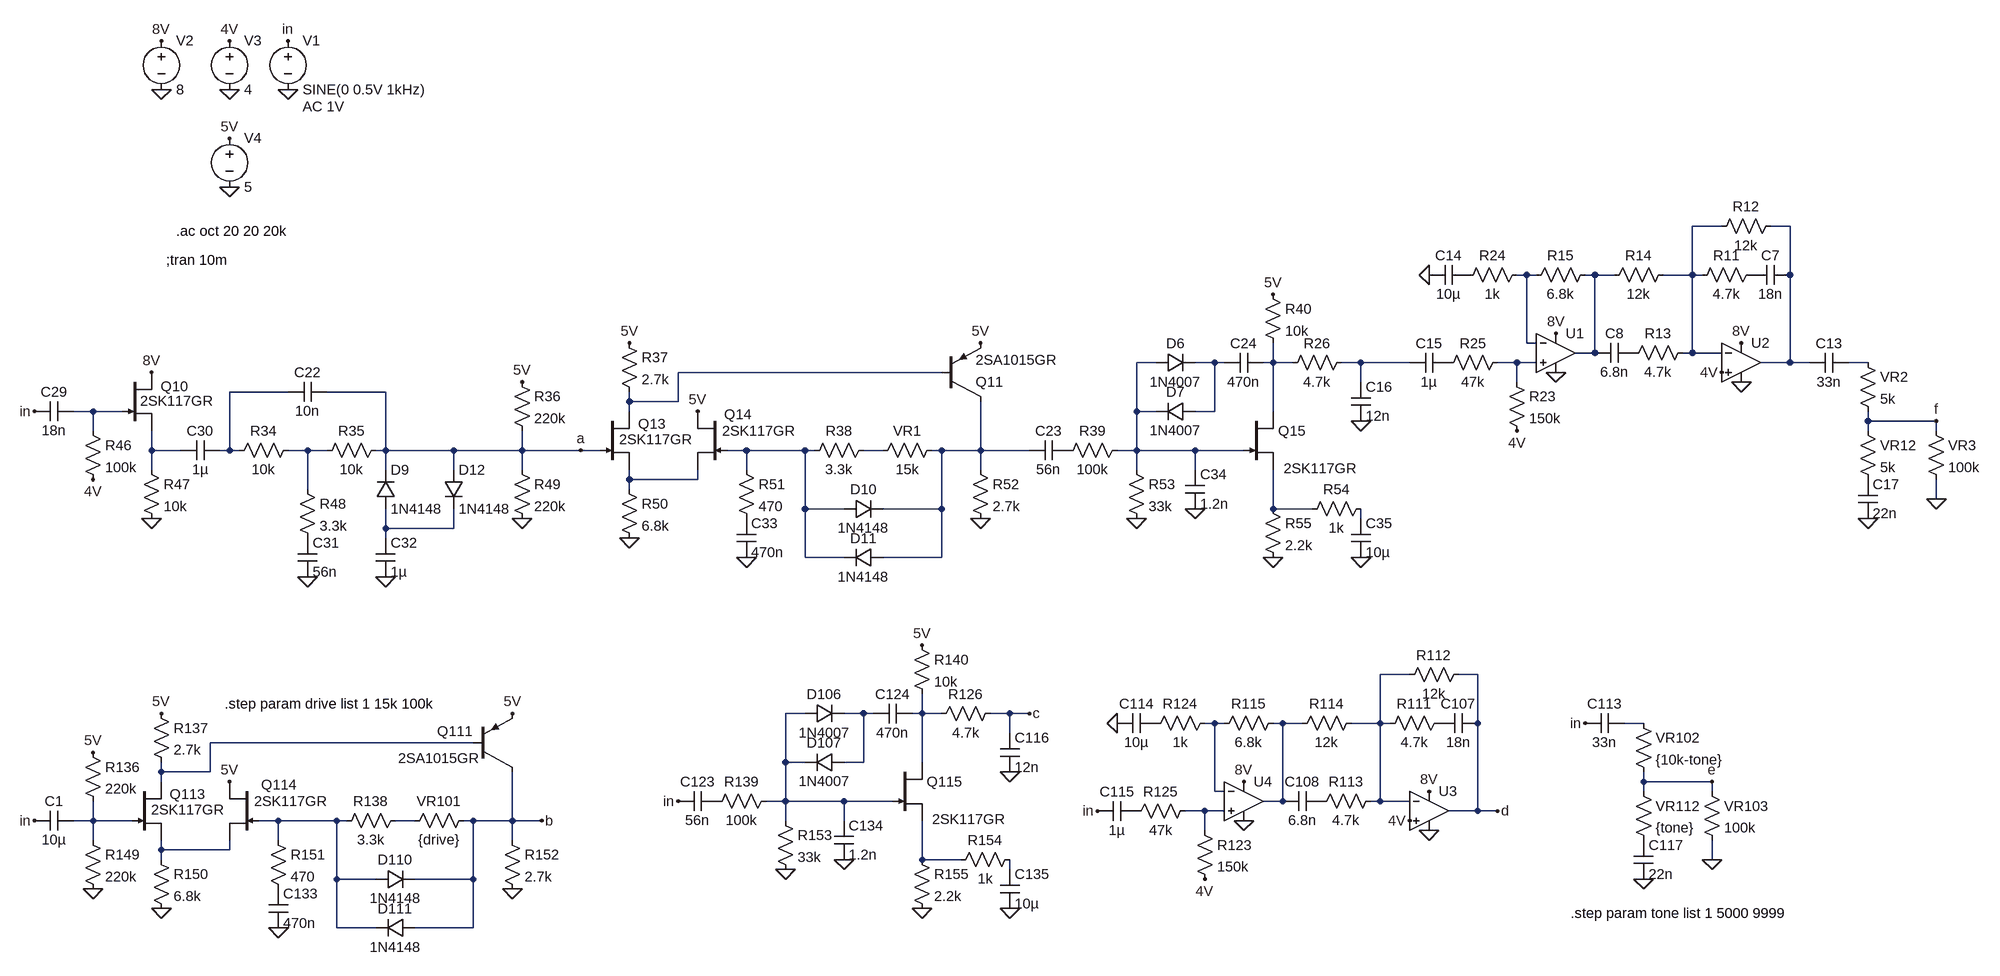
[diagram p0: schematic od3.asc]
od3.asc, the LTspice schematic file:
Version 4
SHEET 1 1624 1740
WIRE 368 -1216 320 -1216
WIRE 480 -1216 448 -1216
WIRE 48 -1136 32 -1136
WIRE 64 -1136 48 -1136
WIRE 160 -1136 144 -1136
WIRE 192 -1136 160 -1136
WIRE 320 -1136 320 -1216
WIRE 320 -1136 272 -1136
WIRE 336 -1136 320 -1136
WIRE 480 -1136 480 -1216
WIRE 48 -1024 48 -1136
WIRE 64 -1024 48 -1024
WIRE 160 -1008 160 -1136
WIRE 160 -1008 128 -1008
WIRE 320 -1008 320 -1136
WIRE 320 -1008 304 -1008
WIRE 368 -1008 320 -1008
WIRE -560 -992 -592 -992
WIRE -464 -992 -496 -992
WIRE -448 -992 -464 -992
WIRE -368 -992 -368 -1024
WIRE -368 -992 -384 -992
WIRE -336 -992 -368 -992
WIRE -224 -992 -256 -992
WIRE -144 -992 -224 -992
WIRE 32 -992 0 -992
WIRE 64 -992 32 -992
WIRE 480 -992 480 -1136
WIRE 480 -992 432 -992
WIRE 512 -992 480 -992
WIRE 608 -992 576 -992
WIRE -912 -976 -1344 -976
WIRE -224 -960 -224 -992
WIRE 32 -960 32 -992
WIRE -1984 -944 -2080 -944
WIRE -1824 -944 -1920 -944
WIRE -1424 -928 -1424 -944
WIRE -1344 -928 -1344 -976
WIRE -1344 -928 -1424 -928
WIRE -2304 -912 -2336 -912
WIRE -2256 -912 -2304 -912
WIRE -1424 -912 -1424 -928
WIRE -592 -912 -592 -992
WIRE -560 -912 -592 -912
WIRE -464 -912 -464 -992
WIRE -464 -912 -496 -912
WIRE -368 -912 -368 -992
WIRE 608 -896 608 -912
WIRE 720 -896 608 -896
WIRE -2304 -880 -2304 -912
WIRE 608 -880 608 -896
WIRE 720 -880 720 -896
WIRE -2208 -848 -2208 -880
WIRE -2160 -848 -2208 -848
WIRE -2080 -848 -2080 -944
WIRE -2080 -848 -2096 -848
WIRE -2064 -848 -2080 -848
WIRE -1952 -848 -1984 -848
WIRE -1920 -848 -1952 -848
WIRE -1824 -848 -1824 -944
WIRE -1824 -848 -1840 -848
WIRE -1712 -848 -1824 -848
WIRE -1600 -848 -1600 -880
WIRE -1600 -848 -1712 -848
WIRE -1504 -848 -1600 -848
WIRE -1472 -848 -1504 -848
WIRE -1232 -848 -1264 -848
WIRE -1136 -848 -1232 -848
WIRE -1120 -848 -1136 -848
WIRE -1008 -848 -1040 -848
WIRE -912 -848 -928 -848
WIRE -848 -848 -848 -928
WIRE -848 -848 -912 -848
WIRE -768 -848 -848 -848
WIRE -592 -848 -592 -912
WIRE -592 -848 -624 -848
WIRE -496 -848 -592 -848
WIRE -416 -848 -496 -848
WIRE -2208 -816 -2208 -848
WIRE -1824 -816 -1824 -848
WIRE -1712 -816 -1712 -848
WIRE -1600 -816 -1600 -848
WIRE -1232 -816 -1232 -848
WIRE -848 -816 -848 -848
WIRE -592 -816 -592 -848
WIRE -496 -816 -496 -848
WIRE -1424 -800 -1424 -816
WIRE -1312 -800 -1312 -816
WIRE -1312 -800 -1424 -800
WIRE -1952 -784 -1952 -848
WIRE -1424 -784 -1424 -800
WIRE 720 -768 720 -800
WIRE -1136 -752 -1136 -848
WIRE -1072 -752 -1136 -752
WIRE -912 -752 -912 -848
WIRE -912 -752 -1008 -752
WIRE -368 -752 -368 -816
WIRE -304 -752 -368 -752
WIRE -224 -736 -224 -752
WIRE -1824 -720 -1824 -752
WIRE -1712 -720 -1712 -752
WIRE -1712 -720 -1824 -720
WIRE -1824 -704 -1824 -720
WIRE -1136 -672 -1136 -752
WIRE -1072 -672 -1136 -672
WIRE -912 -672 -912 -752
WIRE -912 -672 -1008 -672
WIRE -144 -480 -192 -480
WIRE -32 -480 -64 -480
WIRE -1136 -416 -1168 -416
WIRE -1040 -416 -1072 -416
WIRE -1024 -416 -1040 -416
WIRE -944 -416 -944 -448
WIRE -944 -416 -960 -416
WIRE -912 -416 -944 -416
WIRE -800 -416 -832 -416
WIRE -768 -416 -800 -416
WIRE -464 -400 -480 -400
WIRE -448 -400 -464 -400
WIRE -352 -400 -368 -400
WIRE -320 -400 -352 -400
WIRE -192 -400 -192 -480
WIRE -192 -400 -240 -400
WIRE -176 -400 -192 -400
WIRE -32 -400 -32 -480
WIRE 240 -400 208 -400
WIRE -800 -384 -800 -416
WIRE -1680 -368 -2112 -368
WIRE -1168 -336 -1168 -416
WIRE -1136 -336 -1168 -336
WIRE -1040 -336 -1040 -416
WIRE -1040 -336 -1072 -336
WIRE -944 -336 -944 -416
WIRE -2192 -320 -2192 -336
WIRE -2112 -320 -2112 -368
WIRE -2112 -320 -2192 -320
WIRE -2192 -304 -2192 -320
WIRE 240 -304 240 -320
WIRE 352 -304 240 -304
WIRE -464 -288 -464 -400
WIRE -448 -288 -464 -288
WIRE 240 -288 240 -304
WIRE 352 -288 352 -304
WIRE -1168 -272 -1168 -336
WIRE -1168 -272 -1200 -272
WIRE -1072 -272 -1168 -272
WIRE -992 -272 -1072 -272
WIRE -352 -272 -352 -400
WIRE -352 -272 -384 -272
WIRE -192 -272 -192 -400
WIRE -192 -272 -208 -272
WIRE -144 -272 -192 -272
WIRE -480 -256 -512 -256
WIRE -448 -256 -480 -256
WIRE -32 -256 -32 -400
WIRE -32 -256 -80 -256
WIRE 0 -256 -32 -256
WIRE -2304 -240 -2304 -272
WIRE -2304 -240 -2336 -240
WIRE -2240 -240 -2304 -240
WIRE -2000 -240 -2032 -240
WIRE -1904 -240 -2000 -240
WIRE -1888 -240 -1904 -240
WIRE -1776 -240 -1808 -240
WIRE -1680 -240 -1696 -240
WIRE -1616 -240 -1616 -320
WIRE -1616 -240 -1680 -240
WIRE -1568 -240 -1616 -240
WIRE -1168 -240 -1168 -272
WIRE -1072 -240 -1072 -272
WIRE -480 -224 -480 -256
WIRE -2304 -208 -2304 -240
WIRE -2000 -208 -2000 -240
WIRE -1616 -208 -1616 -240
WIRE -2192 -192 -2192 -208
WIRE -2080 -192 -2080 -208
WIRE -2080 -192 -2192 -192
WIRE -2192 -176 -2192 -192
WIRE -944 -176 -944 -240
WIRE -880 -176 -944 -176
WIRE 352 -176 352 -208
WIRE -800 -160 -800 -176
WIRE -1904 -144 -1904 -240
WIRE -1840 -144 -1904 -144
WIRE -1680 -144 -1680 -240
WIRE -1680 -144 -1776 -144
WIRE -1904 -64 -1904 -144
WIRE -1840 -64 -1904 -64
WIRE -1680 -64 -1680 -144
WIRE -1680 -64 -1776 -64
FLAG -1984 -1440 0
FLAG -2192 -1440 0
FLAG -2080 -1440 0
FLAG -1984 -1520 in
FLAG -2192 -1520 8V
FLAG -2080 -1520 4V
FLAG -1952 -640 0
FLAG -1600 -736 0
FLAG 720 -768 0
FLAG 400 -960 0
FLAG -2080 -1280 0
FLAG -2080 -1360 5V
FLAG -1824 -640 0
FLAG -1424 -704 0
FLAG -1232 -672 0
FLAG -848 -736 0
FLAG -592 -736 0
FLAG -496 -752 0
FLAG -368 -672 0
FLAG -224 -672 0
FLAG -224 -896 0
FLAG 96 -976 0
FLAG -112 -1136 0
FLAG 608 -736 0
FLAG -2400 -912 in
FLAG -2304 -128 0
FLAG -1424 -1024 5V
FLAG -848 -1024 5V
FLAG -368 -1104 5V
FLAG 96 -1040 8V
FLAG 400 -1024 8V
FLAG 32 -880 4V
FLAG 368 -976 4V
FLAG -768 -416 c
FLAG 0 -256 d
FLAG 352 -176 0
FLAG 352 -304 e
FLAG 144 -400 in
FLAG 240 -144 0
FLAG -2400 -240 in
FLAG 720 -896 f
FLAG -1312 -912 5V
FLAG -2208 -736 0
FLAG -2304 -800 4V
FLAG -2208 -976 8V
FLAG -1504 -848 a
FLAG -1568 -240 b
FLAG -2192 -96 0
FLAG -2000 -64 0
FLAG -1616 -128 0
FLAG -2192 -416 5V
FLAG -1616 -416 5V
FLAG -2080 -304 5V
FLAG -1168 -160 0
FLAG -1072 -176 0
FLAG -944 -96 0
FLAG -800 -96 0
FLAG -800 -320 0
FLAG -944 -528 5V
FLAG -1344 -272 in
FLAG -112 -224 0
FLAG -416 -240 0
FLAG -624 -400 0
FLAG -416 -304 8V
FLAG -112 -288 8V
FLAG -480 -144 4V
FLAG -144 -240 4V
FLAG -656 -256 in
FLAG -1600 -960 5V
FLAG -2304 -352 5V
SYMBOL voltage -1984 -1536 R0
WINDOW 123 24 124 Left 2
WINDOW 39 0 0 Left 2
SYMATTR Value2 AC 1V
SYMATTR InstName V1
SYMATTR Value SINE(0 0.5V 1kHz)
SYMBOL voltage -2192 -1536 R0
WINDOW 123 0 0 Left 2
WINDOW 39 0 0 Left 2
SYMATTR InstName V2
SYMATTR Value 8
SYMBOL voltage -2080 -1536 R0
WINDOW 123 0 0 Left 2
WINDOW 39 0 0 Left 2
SYMATTR InstName V3
SYMATTR Value 4
SYMBOL cap -1968 -704 R0
SYMATTR InstName C31
SYMATTR Value 56n
SYMBOL cap -2096 -864 R90
WINDOW 0 0 32 VBottom 2
WINDOW 3 32 32 VTop 2
SYMATTR InstName C30
SYMATTR Value 1µ
SYMBOL res -1968 -800 R0
SYMATTR InstName R48
SYMATTR Value 3.3k
SYMBOL cap -1920 -960 R90
WINDOW 0 0 32 VBottom 2
WINDOW 3 32 32 VTop 2
SYMATTR InstName C22
SYMATTR Value 10n
SYMBOL res -1968 -864 R90
WINDOW 0 0 56 VBottom 2
WINDOW 3 32 56 VTop 2
SYMATTR InstName R34
SYMATTR Value 10k
SYMBOL res -1824 -864 R90
WINDOW 0 0 56 VBottom 2
WINDOW 3 32 56 VTop 2
SYMATTR InstName R35
SYMATTR Value 10k
SYMBOL res -1616 -976 R0
SYMATTR InstName R36
SYMATTR Value 220k
SYMBOL res -1616 -832 R0
SYMATTR InstName R49
SYMATTR Value 220k
SYMBOL res 704 -896 R0
SYMATTR InstName VR3
SYMATTR Value 100k
SYMBOL Opamps\\UniversalOpamp2 400 -992 R0
SYMATTR InstName U2
SYMBOL voltage -2080 -1376 R0
WINDOW 123 0 0 Left 2
WINDOW 39 0 0 Left 2
SYMATTR InstName V4
SYMATTR Value 5
SYMBOL diode -1728 -816 R0
SYMATTR InstName D12
SYMATTR Value 1N4148
SYMBOL diode -1840 -752 M180
WINDOW 0 24 64 Left 2
WINDOW 3 24 0 Left 2
SYMATTR InstName D9
SYMATTR Value 1N4148
SYMBOL cap -1840 -704 R0
SYMATTR InstName C32
SYMATTR Value 1µ
SYMBOL njf -1472 -912 R0
WINDOW 3 31 46 Left 2
WINDOW 0 62 21 Left 2
SYMATTR Value 2SK117GR
SYMATTR InstName Q13
SYMBOL res -1440 -800 R0
SYMATTR InstName R50
SYMATTR Value 6.8k
SYMBOL res -1440 -1040 R0
SYMATTR InstName R37
SYMATTR Value 2.7k
SYMBOL njf -1264 -912 M0
WINDOW 0 -41 5 Left 2
WINDOW 3 -114 32 Left 2
SYMATTR InstName Q14
SYMATTR Value 2SK117GR
SYMBOL res -1248 -832 R0
SYMATTR InstName R51
SYMATTR Value 470
SYMBOL cap -1248 -736 R0
SYMATTR InstName C33
SYMATTR Value 470n
SYMBOL diode -1072 -768 M90
WINDOW 0 0 32 VBottom 2
WINDOW 3 32 32 VTop 2
SYMATTR InstName D10
SYMATTR Value 1N4148
SYMBOL res -1024 -864 R90
WINDOW 0 0 56 VBottom 2
WINDOW 3 32 56 VTop 2
SYMATTR InstName R38
SYMATTR Value 3.3k
SYMBOL res -912 -864 R90
WINDOW 0 0 56 VBottom 2
WINDOW 3 32 56 VTop 2
SYMATTR InstName VR1
SYMATTR Value 15k
SYMBOL diode -1008 -688 R90
WINDOW 0 0 32 VBottom 2
WINDOW 3 32 32 VTop 2
SYMATTR InstName D11
SYMATTR Value 1N4148
SYMBOL pnp -912 -928 M180
SYMATTR InstName Q11
SYMATTR Value 2SA1015GR
SYMBOL res -864 -832 R0
SYMATTR InstName R52
SYMATTR Value 2.7k
SYMBOL cap -704 -864 R90
WINDOW 0 0 32 VBottom 2
WINDOW 3 32 32 VTop 2
SYMATTR InstName C23
SYMATTR Value 56n
SYMBOL res -608 -864 R90
WINDOW 0 0 56 VBottom 2
WINDOW 3 32 56 VTop 2
SYMATTR InstName R39
SYMATTR Value 100k
SYMBOL res -608 -832 R0
SYMATTR InstName R53
SYMATTR Value 33k
SYMBOL cap -512 -816 R0
SYMATTR InstName C34
SYMATTR Value 1.2n
SYMBOL diode -560 -1008 M90
WINDOW 0 0 32 VBottom 2
WINDOW 3 32 32 VTop 2
SYMATTR InstName D6
SYMATTR Value 1N4007
SYMBOL diode -496 -928 R90
WINDOW 0 0 32 VBottom 2
WINDOW 3 32 32 VTop 2
SYMATTR InstName D7
SYMATTR Value 1N4007
SYMBOL cap -384 -1008 R90
WINDOW 0 0 32 VBottom 2
WINDOW 3 32 32 VTop 2
SYMATTR InstName C24
SYMATTR Value 470n
SYMBOL njf -416 -912 R0
WINDOW 3 65 94 Left 2
SYMATTR Value 2SK117GR
SYMATTR InstName Q15
SYMBOL res -384 -1120 R0
SYMATTR InstName R40
SYMATTR Value 10k
SYMBOL res -240 -1008 R90
WINDOW 0 0 56 VBottom 2
WINDOW 3 32 56 VTop 2
SYMATTR InstName R26
SYMATTR Value 4.7k
SYMBOL cap -240 -960 R0
SYMATTR InstName C16
SYMATTR Value 12n
SYMBOL res -384 -768 R0
SYMATTR InstName R55
SYMATTR Value 2.2k
SYMBOL res -208 -768 R90
WINDOW 0 0 56 VBottom 2
WINDOW 3 32 56 VTop 2
SYMATTR InstName R54
SYMATTR Value 1k
SYMBOL cap -240 -736 R0
SYMATTR InstName C35
SYMATTR Value 10µ
SYMBOL cap -80 -1008 R90
WINDOW 0 0 32 VBottom 2
WINDOW 3 32 32 VTop 2
SYMATTR InstName C15
SYMATTR Value 1µ
SYMBOL res 16 -1008 R90
WINDOW 0 0 56 VBottom 2
WINDOW 3 32 56 VTop 2
SYMATTR InstName R25
SYMATTR Value 47k
SYMBOL res 16 -976 R0
SYMATTR InstName R23
SYMATTR Value 150k
SYMBOL Opamps\\UniversalOpamp2 96 -1008 R0
SYMATTR InstName U1
SYMBOL res 160 -1152 R90
WINDOW 0 0 56 VBottom 2
WINDOW 3 32 56 VTop 2
SYMATTR InstName R15
SYMATTR Value 6.8k
SYMBOL res 48 -1152 R90
WINDOW 0 0 56 VBottom 2
WINDOW 3 32 56 VTop 2
SYMATTR InstName R24
SYMATTR Value 1k
SYMBOL cap -48 -1152 R90
WINDOW 0 0 32 VBottom 2
WINDOW 3 32 32 VTop 2
SYMATTR InstName C14
SYMATTR Value 10µ
SYMBOL cap 224 -1024 R90
WINDOW 0 0 32 VBottom 2
WINDOW 3 32 32 VTop 2
SYMATTR InstName C8
SYMATTR Value 6.8n
SYMBOL res 320 -1024 R90
WINDOW 0 0 56 VBottom 2
WINDOW 3 32 56 VTop 2
SYMATTR InstName R13
SYMATTR Value 4.7k
SYMBOL res 288 -1152 R90
WINDOW 0 0 56 VBottom 2
WINDOW 3 32 56 VTop 2
SYMATTR InstName R14
SYMATTR Value 12k
SYMBOL res 432 -1152 R90
WINDOW 0 0 56 VBottom 2
WINDOW 3 32 56 VTop 2
SYMATTR InstName R11
SYMATTR Value 4.7k
SYMBOL cap 480 -1152 R90
WINDOW 0 0 32 VBottom 2
WINDOW 3 32 32 VTop 2
SYMATTR InstName C7
SYMATTR Value 18n
SYMBOL res 464 -1232 R90
WINDOW 0 0 56 VBottom 2
WINDOW 3 32 56 VTop 2
SYMATTR InstName R12
SYMATTR Value 12k
SYMBOL cap 576 -1008 R90
WINDOW 0 0 32 VBottom 2
WINDOW 3 32 32 VTop 2
SYMATTR InstName C13
SYMATTR Value 33n
SYMBOL cap 592 -800 R0
SYMATTR InstName C17
SYMATTR Value 22n
SYMBOL res 592 -1008 R0
SYMATTR InstName VR2
SYMATTR Value 5k
SYMBOL res 592 -896 R0
SYMATTR InstName VR12
SYMATTR Value 5k
SYMBOL res -2320 -368 R0
SYMATTR InstName R136
SYMATTR Value 220k
SYMBOL res -2320 -224 R0
SYMATTR InstName R149
SYMATTR Value 220k
SYMBOL cap -2336 -256 R90
WINDOW 0 0 32 VBottom 2
WINDOW 3 32 32 VTop 2
SYMATTR InstName C1
SYMATTR Value 10µ
SYMBOL res 336 -304 R0
SYMATTR InstName VR103
SYMATTR Value 100k
SYMBOL cap 208 -416 R90
WINDOW 0 0 32 VBottom 2
WINDOW 3 32 32 VTop 2
SYMATTR InstName C113
SYMATTR Value 33n
SYMBOL cap 224 -208 R0
SYMATTR InstName C117
SYMATTR Value 22n
SYMBOL res 224 -416 R0
SYMATTR InstName VR102
SYMATTR Value {10k-tone}
SYMBOL res 224 -304 R0
SYMATTR InstName VR112
SYMATTR Value {tone}
SYMBOL njf -2256 -976 R0
WINDOW 3 29 47 Left 2
WINDOW 0 63 23 Left 2
SYMATTR Value 2SK117GR
SYMATTR InstName Q10
SYMBOL res -2224 -832 R0
SYMATTR InstName R47
SYMATTR Value 10k
SYMBOL res -2320 -896 R0
SYMATTR InstName R46
SYMATTR Value 100k
SYMBOL cap -2336 -928 R90
WINDOW 0 0 32 VBottom 2
WINDOW 3 32 32 VTop 2
SYMATTR InstName C29
SYMATTR Value 18n
SYMBOL res -2208 -192 R0
SYMATTR InstName R150
SYMATTR Value 6.8k
SYMBOL res -2208 -432 R0
SYMATTR InstName R137
SYMATTR Value 2.7k
SYMBOL njf -2032 -304 M0
WINDOW 0 -63 5 Left 2
WINDOW 3 -114 32 Left 2
SYMATTR InstName Q114
SYMATTR Value 2SK117GR
SYMBOL res -2016 -224 R0
SYMATTR InstName R151
SYMATTR Value 470
SYMBOL cap -2016 -128 R0
SYMATTR InstName C133
SYMATTR Value 470n
SYMBOL diode -1840 -160 M90
WINDOW 0 0 32 VBottom 2
WINDOW 3 32 32 VTop 2
SYMATTR InstName D110
SYMATTR Value 1N4148
SYMBOL res -1792 -256 R90
WINDOW 0 0 56 VBottom 2
WINDOW 3 32 56 VTop 2
SYMATTR InstName R138
SYMATTR Value 3.3k
SYMBOL res -1680 -256 R90
WINDOW 0 0 56 VBottom 2
WINDOW 3 32 56 VTop 2
SYMATTR InstName VR101
SYMATTR Value {drive}
SYMBOL diode -1776 -80 R90
WINDOW 0 0 32 VBottom 2
WINDOW 3 32 32 VTop 2
SYMATTR InstName D111
SYMATTR Value 1N4148
SYMBOL pnp -1680 -320 M180
WINDOW 0 -59 67 Left 2
WINDOW 3 -123 22 Left 2
SYMATTR InstName Q111
SYMATTR Value 2SA1015GR
SYMBOL res -1632 -224 R0
SYMATTR InstName R152
SYMATTR Value 2.7k
SYMBOL njf -2240 -304 R0
WINDOW 3 31 46 Left 2
WINDOW 0 62 21 Left 2
SYMATTR Value 2SK117GR
SYMATTR InstName Q113
SYMBOL cap -1280 -288 R90
WINDOW 0 0 32 VBottom 2
WINDOW 3 32 32 VTop 2
SYMATTR InstName C123
SYMATTR Value 56n
SYMBOL res -1184 -288 R90
WINDOW 0 0 56 VBottom 2
WINDOW 3 32 56 VTop 2
SYMATTR InstName R139
SYMATTR Value 100k
SYMBOL res -1184 -256 R0
SYMATTR InstName R153
SYMATTR Value 33k
SYMBOL cap -1088 -240 R0
SYMATTR InstName C134
SYMATTR Value 1.2n
SYMBOL diode -1136 -432 M90
WINDOW 0 0 32 VBottom 2
WINDOW 3 32 32 VTop 2
SYMATTR InstName D106
SYMATTR Value 1N4007
SYMBOL diode -1072 -352 R90
WINDOW 0 0 32 VBottom 2
WINDOW 3 32 32 VTop 2
SYMATTR InstName D107
SYMATTR Value 1N4007
SYMBOL cap -960 -432 R90
WINDOW 0 0 32 VBottom 2
WINDOW 3 32 32 VTop 2
SYMATTR InstName C124
SYMATTR Value 470n
SYMBOL njf -992 -336 R0
WINDOW 3 65 94 Left 2
SYMATTR Value 2SK117GR
SYMATTR InstName Q115
SYMBOL res -960 -544 R0
SYMATTR InstName R140
SYMATTR Value 10k
SYMBOL res -816 -432 R90
WINDOW 0 0 56 VBottom 2
WINDOW 3 32 56 VTop 2
SYMATTR InstName R126
SYMATTR Value 4.7k
SYMBOL cap -816 -384 R0
SYMATTR InstName C116
SYMATTR Value 12n
SYMBOL res -960 -192 R0
SYMATTR InstName R155
SYMATTR Value 2.2k
SYMBOL res -784 -192 R90
WINDOW 0 0 56 VBottom 2
WINDOW 3 32 56 VTop 2
SYMATTR InstName R154
SYMATTR Value 1k
SYMBOL cap -816 -160 R0
SYMATTR InstName C135
SYMATTR Value 10µ
SYMBOL Opamps\\UniversalOpamp2 -112 -256 R0
SYMATTR InstName U3
SYMBOL cap -592 -272 R90
WINDOW 0 0 32 VBottom 2
WINDOW 3 32 32 VTop 2
SYMATTR InstName C115
SYMATTR Value 1µ
SYMBOL res -496 -272 R90
WINDOW 0 0 56 VBottom 2
WINDOW 3 32 56 VTop 2
SYMATTR InstName R125
SYMATTR Value 47k
SYMBOL res -496 -240 R0
SYMATTR InstName R123
SYMATTR Value 150k
SYMBOL Opamps\\UniversalOpamp2 -416 -272 R0
SYMATTR InstName U4
SYMBOL res -352 -416 R90
WINDOW 0 0 56 VBottom 2
WINDOW 3 32 56 VTop 2
SYMATTR InstName R115
SYMATTR Value 6.8k
SYMBOL res -464 -416 R90
WINDOW 0 0 56 VBottom 2
WINDOW 3 32 56 VTop 2
SYMATTR InstName R124
SYMATTR Value 1k
SYMBOL cap -560 -416 R90
WINDOW 0 0 32 VBottom 2
WINDOW 3 32 32 VTop 2
SYMATTR InstName C114
SYMATTR Value 10µ
SYMBOL cap -288 -288 R90
WINDOW 0 0 32 VBottom 2
WINDOW 3 32 32 VTop 2
SYMATTR InstName C108
SYMATTR Value 6.8n
SYMBOL res -192 -288 R90
WINDOW 0 0 56 VBottom 2
WINDOW 3 32 56 VTop 2
SYMATTR InstName R113
SYMATTR Value 4.7k
SYMBOL res -224 -416 R90
WINDOW 0 0 56 VBottom 2
WINDOW 3 32 56 VTop 2
SYMATTR InstName R114
SYMATTR Value 12k
SYMBOL res -80 -416 R90
WINDOW 0 0 56 VBottom 2
WINDOW 3 32 56 VTop 2
SYMATTR InstName R111
SYMATTR Value 4.7k
SYMBOL cap -32 -416 R90
WINDOW 0 0 32 VBottom 2
WINDOW 3 32 32 VTop 2
SYMATTR InstName C107
SYMATTR Value 18n
SYMBOL res -48 -496 R90
WINDOW 0 0 56 VBottom 2
WINDOW 3 32 56 VTop 2
SYMATTR InstName R112
SYMATTR Value 12k
TEXT -2168 -1208 Left 2 !.ac oct 20 20 20k
TEXT -2184 -1160 Left 2 !;tran 10m
TEXT 120 -88 Left 2 !.step param tone list 1 5000 9999
TEXT -2088 -432 Left 2 !.step param drive list 1 15k 100k

The netlist it stands for:
* od3.asc
V1 in 0 SINE(0 0.5V 1kHz) AC 1V
V2 8V 0 8
V3 4V 0 4
C31 P001 0 56n
C30 N012 N014 1µ
R48 N015 P001 3.3k
C22 a N012 10n
R34 N015 N012 10k
R35 a N015 10k
R36 5V a 220k
R49 a 0 220k
R§VR3 f 0 100k
XU2 4V N001 8V 0 N002 level.2 Avol=1Meg GBW=10Meg Slew=10Meg ilimit=25m rail=0 Vos=0 phimargin=45 en=0 enk=0 in=0 ink=0 Rin=500Meg  ; pins IN+ IN- V+ V- OUT
V4 5V 0 5
D12 a N022 1N4148
D9 N022 a 1N4148
C32 N022 0 1µ
J§Q13 N011 a N019 2SK117GR
R50 N019 0 6.8k
R37 5V N011 2.7k
J§Q14 5V N016 N019 2SK117GR
R51 N016 P002 470
C33 P002 0 470n
D10 N016 N018 1N4148
R38 N017 N016 3.3k
R§VR1 N018 N017 15k
D11 N018 N016 1N4148
Q11 N018 N011 5V 0 2SA1015GR
R52 N018 0 2.7k
C23 P003 N018 56n
R39 N005 P003 100k
R53 N005 0 33k
C34 N005 0 1.2n
D6 N005 N006 1N4007
D7 N006 N005 1N4007
C24 N007 N006 470n
J§Q15 N007 N005 N020 2SK117GR
R40 5V N007 10k
R26 N008 N007 4.7k
C16 N008 0 12n
R55 N020 0 2.2k
R54 N021 N020 1k
C35 N021 0 10µ
C15 P004 N008 1µ
R25 N009 P004 47k
R23 N009 4V 150k
XU1 N009 N003 8V 0 N004 level.2 Avol=1Meg GBW=10Meg Slew=10Meg ilimit=25m rail=0 Vos=0 phimargin=45 en=0 enk=0 in=0 ink=0 Rin=500Meg  ; pins IN+ IN- V+ V- OUT
R15 N004 N003 6.8k
R24 N003 P005 1k
C14 P005 0 10µ
C8 P006 N004 6.8n
R13 N001 P006 4.7k
R14 N001 N004 12k
R11 P007 N001 4.7k
C7 N002 P007 18n
R12 N002 N001 12k
C13 N010 N002 33n
C17 P008 0 22n
R§VR2 N010 f 5k
R§VR12 f P008 5k
R136 5V N032 220k
R149 N032 0 220k
C1 N032 in 10µ
R§VR103 e 0 100k
C113 N029 in 33n
C117 P009 0 22n
R§VR102 N029 e {10k-tone}
R§VR112 e P009 {tone}
J§Q10 8V N013 N014 2SK117GR
R47 N014 0 10k
R46 N013 4V 100k
C29 N013 in 18n
R150 N035 0 6.8k
R137 5V N030 2.7k
J§Q114 5V N033 N035 2SK117GR
R151 N033 P010 470
C133 P010 0 470n
D110 N033 b 1N4148
R138 N034 N033 3.3k
R§VR101 b N034 {drive}
D111 b N033 1N4148
Q111 b N030 5V 0 2SA1015GR
R152 b 0 2.7k
J§Q113 N030 N032 N035 2SK117GR
C123 P011 in 56n
R139 N024 P011 100k
R153 N024 0 33k
C134 N024 0 1.2n
D106 N024 N025 1N4007
D107 N025 N024 1N4007
C124 N026 N025 470n
J§Q115 N026 N024 N036 2SK117GR
R140 5V N026 10k
R126 c N026 4.7k
C116 c 0 12n
R155 N036 0 2.2k
R154 N037 N036 1k
C135 N037 0 10µ
XU3 4V N023 8V 0 d level.2 Avol=1Meg GBW=10Meg Slew=10Meg ilimit=25m rail=0 Vos=0 phimargin=45 en=0 enk=0 in=0 ink=0 Rin=500Meg  ; pins IN+ IN- V+ V- OUT
C115 P012 in 1µ
R125 N031 P012 47k
R123 N031 4V 150k
XU4 N031 N027 8V 0 N028 level.2 Avol=1Meg GBW=10Meg Slew=10Meg ilimit=25m rail=0 Vos=0 phimargin=45 en=0 enk=0 in=0 ink=0 Rin=500Meg  ; pins IN+ IN- V+ V- OUT
R115 N028 N027 6.8k
R124 N027 P013 1k
C114 P013 0 10µ
C108 P014 N028 6.8n
R113 N023 P014 4.7k
R114 N023 N028 12k
R111 P015 N023 4.7k
C107 d P015 18n
R112 d N023 12k
.model D D
.lib standard.dio
.model NPN NPN
.model PNP PNP
.lib standard.bjt
.model NJF NJF
.model PJF PJF
.lib standard.jft
.ac oct 20 20 20k
;tran 10m
.step param tone list 1 5000 9999
.step param drive list 1 15k 100k
.lib UniversalOpamps2.sub
.backanno
.end